# Altium project AMC_BOX_Backplane.PrjPCB
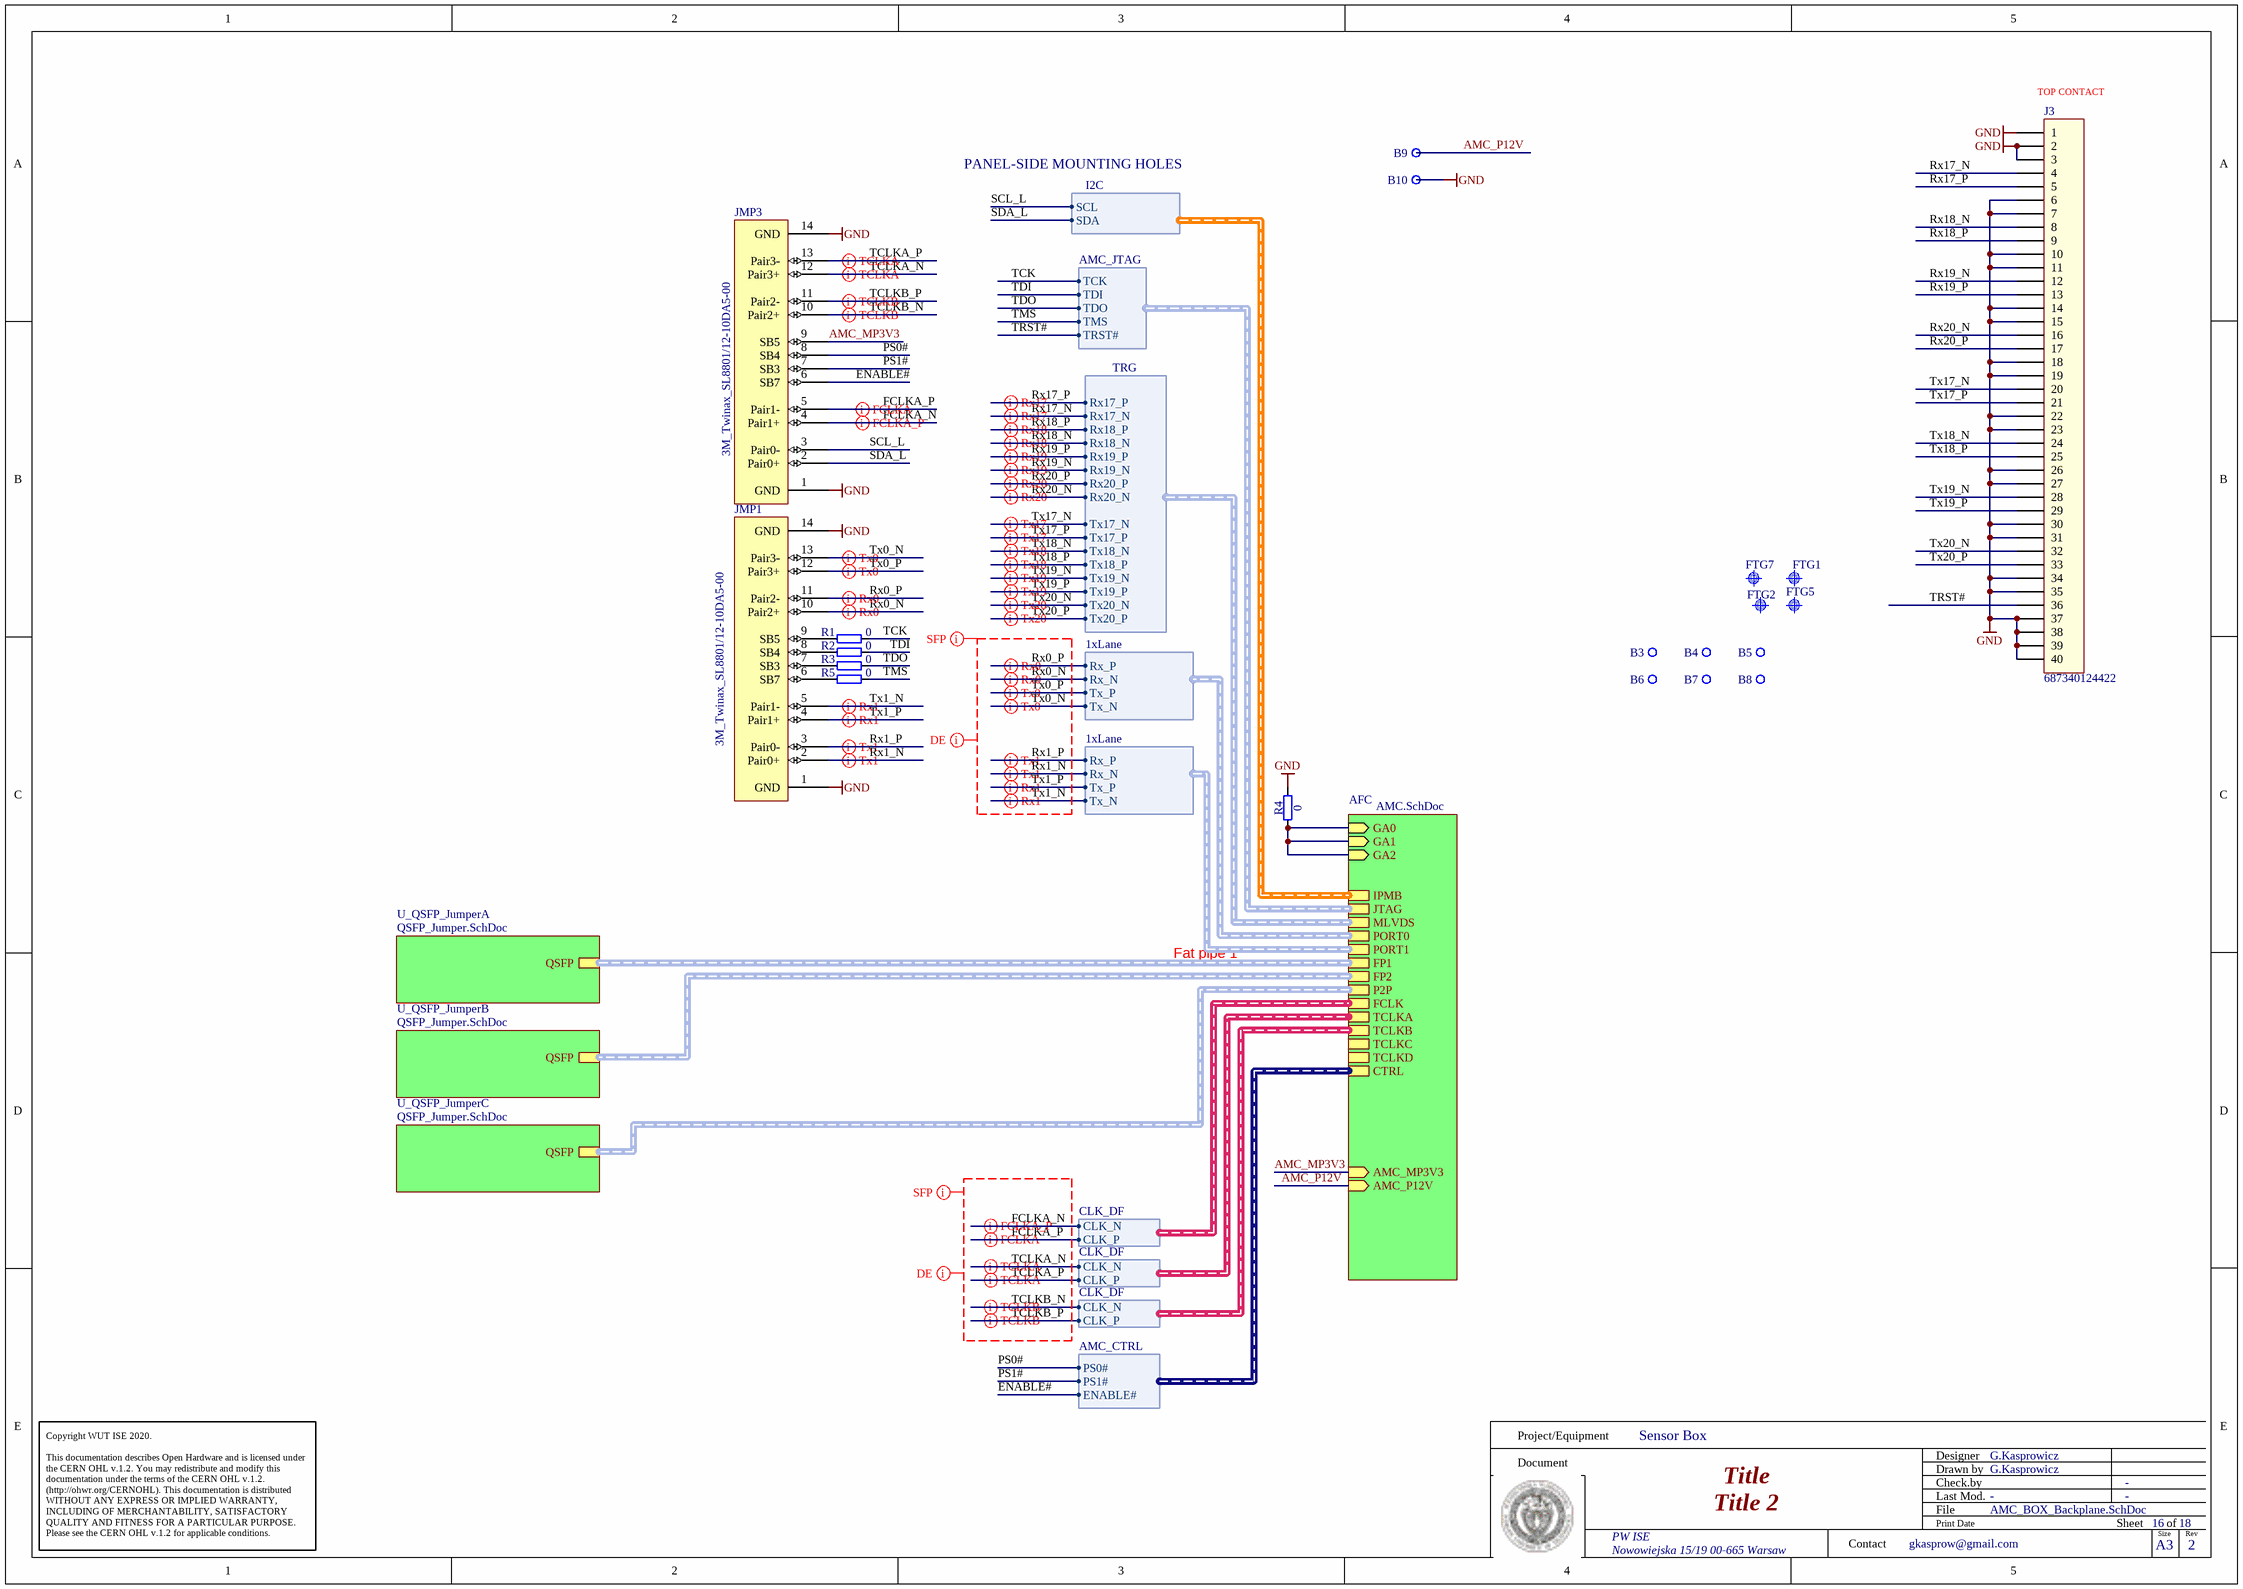
[diagram p0: AMC_BOX_Backplane.SchDoc]
3 sheets, 29 parts. Net scope: hierarchical (ports join the sheet entries above them; power ports are global).
Board file: AMC_Single_uBACKPLANE.PcbDoc
Sheets:
  AMC_BOX_Backplane.SchDoc
    AFC = AMC.SchDoc
    U_QSFP_JumperA = QSFP_Jumper.SchDoc
    U_QSFP_JumperB = QSFP_Jumper.SchDoc
    U_QSFP_JumperC = QSFP_Jumper.SchDoc

## Sheet AMC_BOX_Backplane.SchDoc: Title
size 420 x 297 mm; Author: G.Kasprowicz; CompanyName: WUT ISE; DrawnBy: G.Kasprowicz; Organization: WUT ISE; Address1: PW ISE; Address2: Nowowiejska 15/19 00-665 Warsaw; Address3: gkasprow@gmail.com; DocumentNumber: 16; Revision: 2; SheetNumber: 16; SheetTotal: 18; ModifiedBy: -; CheckedDate: -; Title2: Title 2; DivGrp: WUT ISE; Designer: G.Kasprowicz; ModifiedDate: -; ProjectName: Sensor Box

### Parts
B3  Plated Hole  [MTG320_550]  (value not drawn)
B4  Plated Hole  [MTG320_550]  (value not drawn)
B5  Plated Hole  [MTG320_550]  (value not drawn)
B6  Plated Hole  [MTG320_550]  (value not drawn)
B7  Plated Hole  [MTG320_550]  (value not drawn)
B8  Plated Hole  [MTG320_550]  (value not drawn)
B9  Plated Hole  [c200h150]  (value not drawn)
B10  Plated Hole  [c200h150]  (value not drawn)
FTG1  Use only in PCB  [FIDUCIAL_TOP_S100-200]  (value not drawn)
FTG2  Use only in PCB  [FIDUCIAL_TOP_S100-200]  (value not drawn)
FTG5  Use only in PCB  [FIDUCIAL_TOP_S100-200]  (value not drawn)
FTG7  Use only in PCB  [FIDUCIAL_TOP_S100-200]  (value not drawn)
J3  687340124422  [687340124422]
JMP1  3M_Twinax_SL8801/12-10DA5-00  [3M_Twinax_SL8801/12-10DA5-00]
JMP3  3M_Twinax_SL8801/12-10DA5-00  [3M_Twinax_SL8801/12-10DA5-00]
R1  0  [RESC1005X40N]
R2  0  [RESC1005X40N]
R3  0  [RESC1005X40N]
R4  0  [RESC1005X40N]
R5  0  [RESC1005X40N]

### Sub-sheets
AFC = AMC.SchDoc: GA0 (in), GA1 (in), GA2 (in), MLVDS (harness TRG), PORT0 (harness 1xLane), FP2 (harness FP), PORT1 (harness 1xLane), FCLK (harness CLK_DF), TCLKA (harness CLK_DF), TCLKB (harness CLK_DF), TCLKC (harness CLK_DF), TCLKD (harness CLK_DF), FP1 (harness QSFP), AMC_P12V (in), AMC_MP3V3 (in), IPMB (harness I2C), CTRL (harness AMC_CTRL), P2P (harness FP), JTAG (harness AMC_JTAG)
U_QSFP_JumperA = QSFP_Jumper.SchDoc: QSFP (harness QSFP)
U_QSFP_JumperB = QSFP_Jumper.SchDoc: QSFP (harness QSFP)
U_QSFP_JumperC = QSFP_Jumper.SchDoc: QSFP (harness QSFP)

### Harnesses
I2C: SCL, SDA
1xLane: Rx_P, Rx_N, Tx_P, Tx_N
CLK_DF: CLK_P, CLK_N
AMC_CTRL: PS0#, PS1#, ENABLE#
TRG: Rx17_P, Rx17_N, Rx18_P, Rx18_N, Rx19_P, Rx19_N, Rx20_P, Rx20_N, Tx17_N, Tx17_P, Tx18_N, Tx18_P, Tx19_N, Tx19_P, Tx20_N, Tx20_P
AMC_JTAG: TCK, TDI, TDO, TMS, TRST#

### Nets
GND: B10.1 J3.1 J3.2 J3.3 J3.6 J3.7 J3.10 J3.11 J3.14 J3.15 J3.18 J3.19 J3.22 J3.23 J3.26 J3.27 J3.30 J3.31 J3.34 J3.35 J3.37 J3.38 J3.39 J3.40 JMP1.1(GND) JMP1.14(GND) JMP3.1(GND) JMP3.14(GND) R4.2
AMC_MP3V3: JMP3.9(SB5) ; sheet AFC/AMC_MP3V3
AMC_P12V: B9.1 ; sheet AFC/AMC_P12V
ENABLE#: JMP3.6(SB7) ; sheet AFC/CTRL.ENABLE#
FCLKA_N: JMP3.4(Pair1+) ; sheet AFC/FCLK.CLK_N
FCLKA_P: JMP3.5(Pair1-) ; sheet AFC/FCLK.CLK_P
GA0: R4.1 ; sheet AFC/GA0, sheet AFC/GA1, sheet AFC/GA2
PS0#: JMP3.8(SB4) ; sheet AFC/CTRL.PS0#
PS1#: JMP3.7(SB3) ; sheet AFC/CTRL.PS1#
Rx0_N: JMP1.10(Pair2+) ; sheet AFC/PORT0.Rx_N
Rx0_P: JMP1.11(Pair2-) ; sheet AFC/PORT0.Rx_P
Rx1_N: JMP1.2(Pair0+) ; sheet AFC/PORT1.Rx_N
Rx1_P: JMP1.3(Pair0-) ; sheet AFC/PORT1.Rx_P
Rx17_N: J3.4 ; sheet AFC/MLVDS.Rx17_N
Rx17_P: J3.5 ; sheet AFC/MLVDS.Rx17_P
Rx18_N: J3.8 ; sheet AFC/MLVDS.Rx18_N
Rx18_P: J3.9 ; sheet AFC/MLVDS.Rx18_P
Rx19_N: J3.12 ; sheet AFC/MLVDS.Rx19_N
Rx19_P: J3.13 ; sheet AFC/MLVDS.Rx19_P
Rx20_N: J3.16 ; sheet AFC/MLVDS.Rx20_N
Rx20_P: J3.17 ; sheet AFC/MLVDS.Rx20_P
SCL_L: JMP3.3(Pair0-) ; sheet AFC/IPMB.SCL
SDA_L: JMP3.2(Pair0+) ; sheet AFC/IPMB.SDA
TCK: R1.2 ; sheet AFC/JTAG.TCK
TCLKA_N: JMP3.12(Pair3+) ; sheet AFC/TCLKA.CLK_N
TCLKA_P: JMP3.13(Pair3-) ; sheet AFC/TCLKA.CLK_P
TCLKB_N: JMP3.10(Pair2+) ; sheet AFC/TCLKB.CLK_N
TCLKB_P: JMP3.11(Pair2-) ; sheet AFC/TCLKB.CLK_P
TDI: R2.2 ; sheet AFC/JTAG.TDI
TDO: R3.2 ; sheet AFC/JTAG.TDO
TMS: R5.2 ; sheet AFC/JTAG.TMS
TRST#: J3.36 ; sheet AFC/JTAG.TRST#
Tx0_N: JMP1.13(Pair3-) ; sheet AFC/PORT0.Tx_N
Tx0_P: JMP1.12(Pair3+) ; sheet AFC/PORT0.Tx_P
Tx1_N: JMP1.5(Pair1-) ; sheet AFC/PORT1.Tx_N
Tx1_P: JMP1.4(Pair1+) ; sheet AFC/PORT1.Tx_P
Tx17_N: J3.20 ; sheet AFC/MLVDS.Tx17_N
Tx17_P: J3.21 ; sheet AFC/MLVDS.Tx17_P
Tx18_N: J3.24 ; sheet AFC/MLVDS.Tx18_N
Tx18_P: J3.25 ; sheet AFC/MLVDS.Tx18_P
Tx19_N: J3.28 ; sheet AFC/MLVDS.Tx19_N
Tx19_P: J3.29 ; sheet AFC/MLVDS.Tx19_P
Tx20_N: J3.32 ; sheet AFC/MLVDS.Tx20_N
Tx20_P: J3.33 ; sheet AFC/MLVDS.Tx20_P
NetJMP1_6: JMP1.6(SB7) R5.1
NetJMP1_7: JMP1.7(SB3) R3.1
NetJMP1_8: JMP1.8(SB4) R2.1
NetJMP1_9: JMP1.9(SB5) R1.1

Not connected (* = marked no-connect by the designer): B3 1; B4 1; B5 1; B6 1; B7 1; B8 1

### Buses and harness runs
harness sheet AFC/FP1 = sheet U_QSFP_JumperA/QSFP
harness sheet AFC/FP2 = sheet U_QSFP_JumperB/QSFP
harness sheet AFC/P2P = sheet U_QSFP_JumperC/QSFP

### Layout directives
differential pair: FCLKA_N, FCLKA_P, Rx0_N, Rx0_P, Rx1_N, Rx1_P, Rx17_N, Rx17_P, Rx18_N, Rx18_P, Rx19_N, Rx19_P, Rx20_N, Rx20_P, TCLKA_N, TCLKA_P, TCLKB_N, TCLKB_P, Tx0_N, Tx0_P, Tx1_N, Tx1_P, Tx17_N, Tx17_P, Tx18_N, Tx18_P, Tx19_N, Tx19_P, Tx20_N, Tx20_P
net class SFP: FCLKA_N, FCLKA_P, Rx0_N, Rx0_P, Rx1_N, Rx1_P, TCLKA_N, TCLKA_P, TCLKB_N, TCLKB_P, Tx0_N, Tx0_P, Tx1_N, Tx1_P
net class DE: FCLKA_N, FCLKA_P, Rx0_N, Rx0_P, Rx1_N, Rx1_P, TCLKA_N, TCLKA_P, TCLKB_N, TCLKB_P, Tx0_N, Tx0_P, Tx1_N, Tx1_P

### Notes on the sheet
- (near J3) TOP CONTACT
- PANEL-SIDE MOUNTING HOLES
- Fat pipe 1
- Project/Equipment
- Document
- Designer
- Drawn by
- Check.by
- Copyright WUT ISE 2020.
  This documentation describes Open Hardware and is licensed under the CERN OHL v.1.2. You may redistribute and modify this documentation under the terms of the CERN OHL v.1.2. (http://ohwr.org/CERNOHL). This documentation is distributed WITHOUT ANY EXPRESS OR IMPLIED WARRANTY, INCLUDING OF MERCHANTABILITY, SATISFACTORY QUALITY AND FITNESS FOR A PARTICULAR PURPOSE. Please see the CERN OHL v.1.2 for applicable conditions.
- Contact
- File
- Last Mod.
- Print Date
- Sheet
- Size
- A3
- of
- Rev

### Library data of the parts
B3-B8 = PLATED_HOLE3.2_PAD5.5: Single Terminal Socket; Part Description: Plated Through Hole: Hole Dia.=3.2mm Pad Dia.=5.5mm; Mounted: No; Part Number: PLATED_HOLE3.2_PAD5.5; Component Kind: Standard (No BOM); Component Type: Standard (No BOM); Pin Count: 1; Family: Plated Hole; Socket: No; SMD: No; Sense: No; Status: None; ComponentHeight: 0mm; HelpURL: Undefined; Author: CERN DEM JMW; CreateDate: 01.10.2012; LatestRevisionDate: 01.10.2012; PackageDescription: Plated Through Hole: Hole Dia.=3.2mm Pad Dia.=5.5mm
B9 B10 = PLATED_HOLE1.5_PAD2.0: Single Terminal Socket; Part Description: Plated Through Hole: Hole Dia.=1.5mm Pad Dia.=2.0mm, IPC-7251 Level C; Mounted: No; Part Number: PLATED_HOLE1.5_PAD2.0; Component Kind: Standard (No BOM); Component Type: Standard (No BOM); Pin Count: 1; Family: Plated Hole; Socket: No; SMD: No; Sense: No; Status: None; ComponentHeight: 0mm; HelpURL: Undefined; Author: CERN DEM JLC; CreateDate: 30.10.2008; LatestRevisionDate: 30.10.2008; PackageDescription: Plated Through Hole: Hole Dia.=1.5mm Pad Dia.=2.0mm, IPC-7251 Level C
FTG1 FTG2 FTG5 FTG7 = FIDUCIAL_TARGET_S100-200: Fiducial Target; Part Description: Square Fiducial Target, Top Layer, 1.0mm, Top Solder 2.0mm, Keepout =2.0mm; Mounted: No; Table: Pads; Part Number: FIDUCIAL_TARGET_S100-200; Component Kind: Standard (No BOM); Component Type: Standard (No BOM); Pin Count: 1; Family: Fiducial; Socket: No; SMD: Yes; Status: None; ComponentHeight: 0mm; Author: CERN DEM JLC; CreateDate: 2010-02-09; LatestRevisionDate: 2012-04-04; PackageDescription: Square Fiducial Target, Top Layer, 1.0mm, Top Solder 2.0mm, Keepout =2.0mm
J3 = 687340124422: 0.50 mm SMT ZIF Vertical WR-FPC, 40 pins; Pitch: 0.5 mm; Pin Number: 40; ComponentLink1Description: Manufacturer; ComponentLink1URL: http://www.we-online.de; ComponentLink2Description: Datasheet; ComponentLink2URL: http://katalog.we-online.com/em/datasheet/6873xx124422.pdf; Part Number: 687340124422; Published Date: April 2017; Publisher: Wurth Elektronik
JMP1 JMP3 = CBL_TWINAX_3M_4pairs_SB: Flat Ribbon Cable Silver 8 (4 Pair) Conductors 0.093" (2.37mm) Between Pairs Flat Twin Axial 500.0' (152.40m)
R1-R5 = R0402_0R_JUMPER: Resistor; Part Description: 1A (0.05R Max DC Resistance) Zero Ohm Jumper; Manufacturer: GENERIC; Manufacturer1 Part Number: 232270591001L; Table: Resistors SMD; Part Number: R0402_0R_JUMPER; Component Kind: Standard; Component Type: Standard; Pin Count: 2; Value: 0; Status: Not recommended; Manufacturer Part Number: R0402_0R_JUMPER; Case: 0402; Mounted: Yes; Socket: No; SMD: Yes; Manufacturer1 Example: YAGEO PHYCOMP; Manufacturer1 ComponentHeight: 0.4mm; HelpURL: \\cern.ch\dfs\Applications\Altium\Datasheets\R0402_Phycomp_RC0402.pdf; Author: CERN DEM JLC; CreateDate: 2007-12-03; LatestRevisionDate: 2012-10-17

## Sheet AMC.SchDoc: Title
size 420 x 297 mm; Author: G.Kasprowicz; CompanyName: WUT ISE; DrawnBy: G.Kasprowicz; Organization: WUT ISE; Address1: PW ISE; Address2: Nowowiejska 15/19 00-665 Warsaw; Address3: gkasprow@gmail.com; DocumentNumber: 17; Revision: 2; SheetNumber: 17; SheetTotal: 18; ModifiedBy: -; CheckedDate: -; Title2: Title 2; DivGrp: WUT ISE; Designer: G.Kasprowicz; ModifiedDate: -; ProjectName: Sensor Box
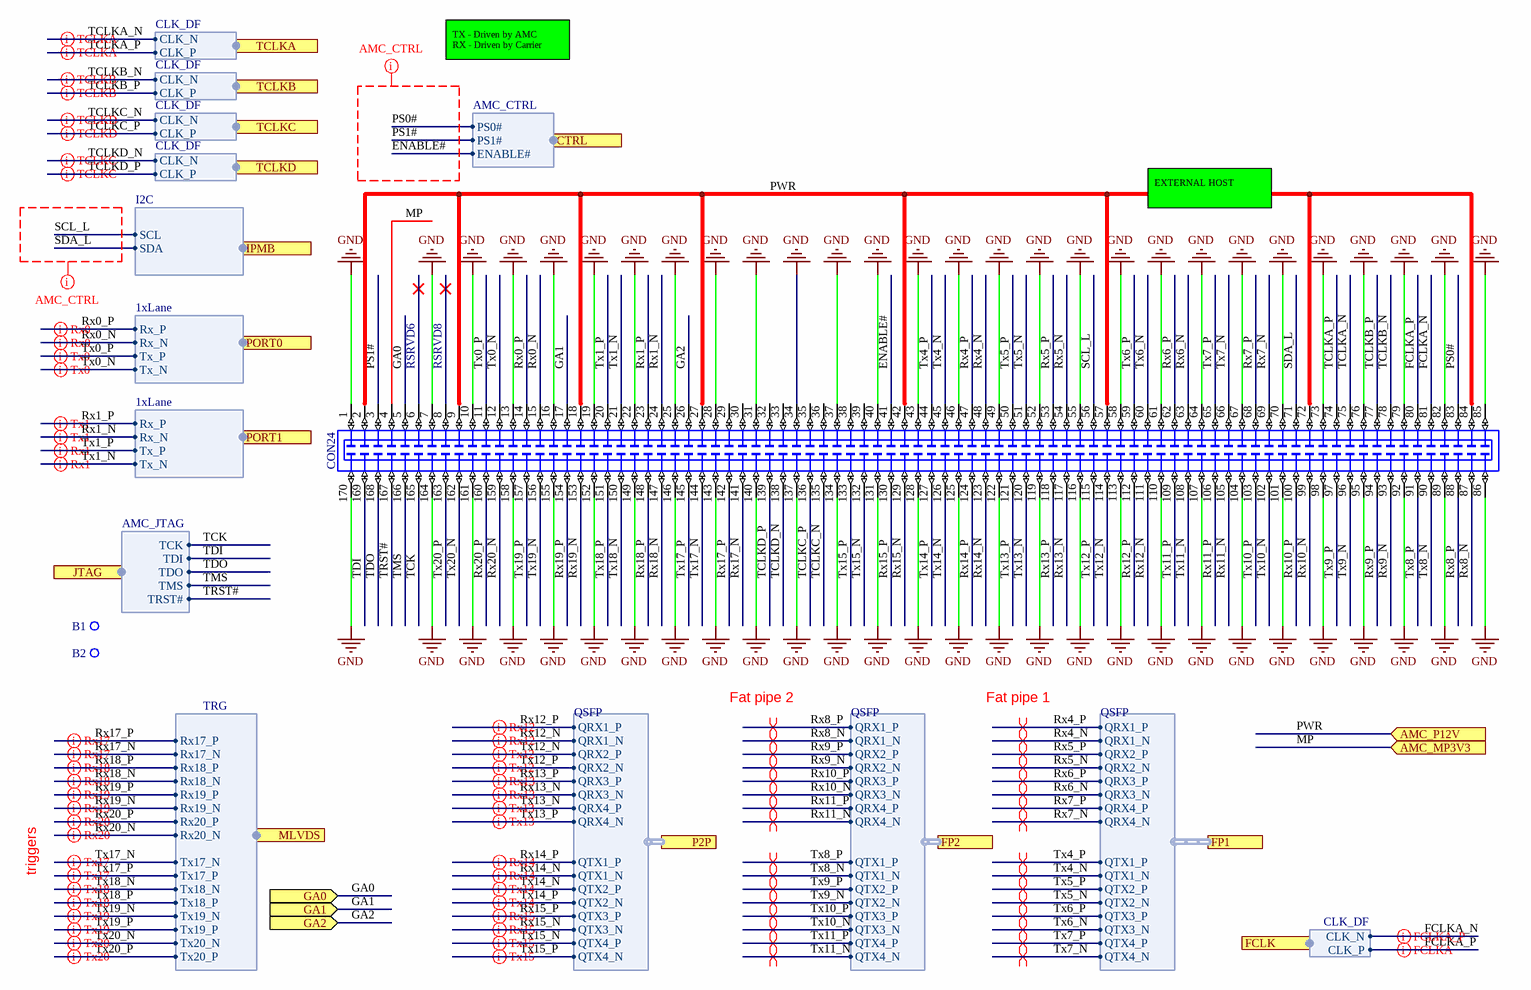
[diagram p1: AMC.SchDoc]

### Parts
B1  Plated Hole  [MTG320_550]  (value not drawn)
B2  Plated Hole  [MTG320_550]  (value not drawn)
CON24  SAMTEC_MTCA-085-02-S-DV-SMT-K-TR  [SAMTEC_MTCA-085-02-S-DV-SMT-K-TR]  (value not drawn)

### Ports
AMC_MP3V3 (in), AMC_P12V (in), CTRL (harness AMC_CTRL), FCLK (harness CLK_DF), FP1 (harness QSFP), FP2 (harness QSFP), GA0 (in), GA1 (in), GA2 (in), IPMB (harness I2C), JTAG (harness AMC_JTAG), MLVDS (harness TRG), P2P (harness QSFP), PORT0 (harness 1xLane), PORT1 (harness 1xLane), TCLKA (harness CLK_DF), TCLKB (harness CLK_DF), TCLKC (harness CLK_DF), TCLKD (harness CLK_DF)

### Harnesses
TRG: Rx17_P, Rx17_N, Rx18_P, Rx18_N, Rx19_P, Rx19_N, Rx20_P, Rx20_N, Tx17_N, Tx17_P, Tx18_N, Tx18_P, Tx19_N, Tx19_P, Tx20_N, Tx20_P
1xLane: Rx_P, Rx_N, Tx_P, Tx_N
I2C: SCL, SDA
CLK_DF: CLK_P, CLK_N
AMC_CTRL: PS0#, PS1#, ENABLE#
AMC_JTAG: TCK, TDI, TDO, TMS, TRST#
QSFP: QRX1_P, QRX1_N, QRX2_P, QRX2_N, QRX3_P, QRX3_N, QRX4_P, QRX4_N, QTX1_P, QTX1_N, QTX2_P, QTX2_N, QTX3_P, QTX3_N, QTX4_P, QTX4_N

### Nets
GND: CON24.1 CON24.7 CON24.10 CON24.13 CON24.16 CON24.19 CON24.22 CON24.25 CON24.28 CON24.31 CON24.34 CON24.37 CON24.40 CON24.43 CON24.46 CON24.49 CON24.52 CON24.55 CON24.58 CON24.61 CON24.64 CON24.67 CON24.70 CON24.73 CON24.76 CON24.79 CON24.82 CON24.85 CON24.86 CON24.89 CON24.92 CON24.95 CON24.98 CON24.101 CON24.104 CON24.107 CON24.110 CON24.113 CON24.116 CON24.119 CON24.122 CON24.125 CON24.128 CON24.131 CON24.134 CON24.137 CON24.140 CON24.143 CON24.146 CON24.149 CON24.152 CON24.155 CON24.158 CON24.161 CON24.164 CON24.170
ENABLE#: CON24.41 ; port CTRL.ENABLE#
FCLKA_N: CON24.81 ; port FCLK.CLK_N
FCLKA_P: CON24.80 ; port FCLK.CLK_P
GA0: CON24.5 CON24.17 CON24.26 ; port GA1, port GA2, port GA0  [also labelled GA1, GA2]
MP: CON24.4 ; port AMC_MP3V3  [project net AMC_MP3V3]
PS0#: CON24.83 ; port CTRL.PS0#
PS1#: CON24.3 ; port CTRL.PS1#
PWR: CON24.2 CON24.9 CON24.18 CON24.27 CON24.42 CON24.57 CON24.72 CON24.84 ; port AMC_P12V  [project net AMC_P12V]
Rx0_N: CON24.15 ; port PORT0.Rx_N
Rx0_P: CON24.14 ; port PORT0.Rx_P
Rx1_N: CON24.24 ; port PORT1.Rx_N
Rx1_P: CON24.23 ; port PORT1.Rx_P
Rx4_N: CON24.48 ; port FP1.QRX1_N  [project net QRX1_N]
Rx4_P: CON24.47 ; port FP1.QRX1_P  [project net QRX1_P]
Rx5_N: CON24.54 ; port FP1.QRX2_N  [project net QRX2_N]
Rx5_P: CON24.53 ; port FP1.QRX2_P  [project net QRX2_P]
Rx6_N: CON24.63 ; port FP1.QRX3_N  [project net QRX3_N]
Rx6_P: CON24.62 ; port FP1.QRX3_P  [project net QRX3_P]
Rx7_N: CON24.69 ; port FP1.QRX4_N  [project net QRX4_N]
Rx7_P: CON24.68 ; port FP1.QRX4_P  [project net QRX4_P]
Rx8_N: CON24.87 ; port FP2.QRX1_N  [project net QRX1_N]
Rx8_P: CON24.88 ; port FP2.QRX1_P  [project net QRX1_P]
Rx9_N: CON24.93 ; port FP2.QRX2_N  [project net QRX2_N]
Rx9_P: CON24.94 ; port FP2.QRX2_P  [project net QRX2_P]
Rx10_N: CON24.99 ; port FP2.QRX3_N  [project net QRX3_N]
Rx10_P: CON24.100 ; port FP2.QRX3_P  [project net QRX3_P]
Rx11_N: CON24.105 ; port FP2.QRX4_N  [project net QRX4_N]
Rx11_P: CON24.106 ; port FP2.QRX4_P  [project net QRX4_P]
Rx12_N: CON24.111 ; port P2P.QRX1_N  [project net QRX1_N]
Rx12_P: CON24.112 ; port P2P.QRX1_P  [project net QRX1_P]
Rx13_N: CON24.117 ; port P2P.QRX3_N  [project net QRX3_N]
Rx13_P: CON24.118 ; port P2P.QRX3_P  [project net QRX3_P]
Rx14_N: CON24.123 ; port P2P.QTX1_N  [project net QTX1_N]
Rx14_P: CON24.124 ; port P2P.QTX1_P  [project net QTX1_P]
Rx15_N: CON24.129 ; port P2P.QTX3_N  [project net QTX3_N]
Rx15_P: CON24.130 ; port P2P.QTX3_P  [project net QTX3_P]
Rx17_N: CON24.141 ; port MLVDS.Rx17_N
Rx17_P: CON24.142 ; port MLVDS.Rx17_P
Rx18_N: CON24.147 ; port MLVDS.Rx18_N
Rx18_P: CON24.148 ; port MLVDS.Rx18_P
Rx19_N: CON24.153 ; port MLVDS.Rx19_N
Rx19_P: CON24.154 ; port MLVDS.Rx19_P
Rx20_N: CON24.159 ; port MLVDS.Rx20_N
Rx20_P: CON24.160 ; port MLVDS.Rx20_P
SCL_L: CON24.56 ; port IPMB.SCL
SDA_L: CON24.71 ; port IPMB.SDA
TCK: CON24.165 ; port JTAG.TCK
TCLKA_N: CON24.75 ; port TCLKA.CLK_N
TCLKA_P: CON24.74 ; port TCLKA.CLK_P
TCLKB_N: CON24.78 ; port TCLKB.CLK_N
TCLKB_P: CON24.77 ; port TCLKB.CLK_P
TCLKC_N: CON24.135 ; port TCLKC.CLK_N
TCLKC_P: CON24.136 ; port TCLKC.CLK_P
TCLKD_N: CON24.138 ; port TCLKD.CLK_N
TCLKD_P: CON24.139 ; port TCLKD.CLK_P
TDI: CON24.169 ; port JTAG.TDI
TDO: CON24.168 ; port JTAG.TDO
TMS: CON24.166 ; port JTAG.TMS
TRST#: CON24.167 ; port JTAG.TRST#
Tx0_N: CON24.12 ; port PORT0.Tx_N
Tx0_P: CON24.11 ; port PORT0.Tx_P
Tx1_N: CON24.21 ; port PORT1.Tx_N
Tx1_P: CON24.20 ; port PORT1.Tx_P
Tx4_N: CON24.45 ; port FP1.QTX1_N  [project net QTX1_N]
Tx4_P: CON24.44 ; port FP1.QTX1_P  [project net QTX1_P]
Tx5_N: CON24.51 ; port FP1.QTX2_N  [project net QTX2_N]
Tx5_P: CON24.50 ; port FP1.QTX2_P  [project net QTX2_P]
Tx6_N: CON24.60 ; port FP1.QTX3_N  [project net QTX3_N]
Tx6_P: CON24.59 ; port FP1.QTX3_P  [project net QTX3_P]
Tx7_N: CON24.66 ; port FP1.QTX4_N  [project net QTX4_N]
Tx7_P: CON24.65 ; port FP1.QTX4_P  [project net QTX4_P]
Tx8_N: CON24.90 ; port FP2.QTX1_N  [project net QTX1_N]
Tx8_P: CON24.91 ; port FP2.QTX1_P  [project net QTX1_P]
Tx9_N: CON24.96 ; port FP2.QTX2_N  [project net QTX2_N]
Tx9_P: CON24.97 ; port FP2.QTX2_P  [project net QTX2_P]
Tx10_N: CON24.102 ; port FP2.QTX3_N  [project net QTX3_N]
Tx10_P: CON24.103 ; port FP2.QTX3_P  [project net QTX3_P]
Tx11_N: CON24.108 ; port FP2.QTX4_N  [project net QTX4_N]
Tx11_P: CON24.109 ; port FP2.QTX4_P  [project net QTX4_P]
Tx12_N: CON24.114 ; port P2P.QRX2_P  [project net QRX2_P]
Tx12_P: CON24.115 ; port P2P.QRX2_N  [project net QRX2_N]
Tx13_N: CON24.120 ; port P2P.QRX4_P  [project net QRX4_P]
Tx13_P: CON24.121 ; port P2P.QRX4_N  [project net QRX4_N]
Tx14_N: CON24.126 ; port P2P.QTX2_P  [project net QTX2_P]
Tx14_P: CON24.127 ; port P2P.QTX2_N  [project net QTX2_N]
Tx15_N: CON24.132 ; port P2P.QTX4_P  [project net QTX4_P]
Tx15_P: CON24.133 ; port P2P.QTX4_N  [project net QTX4_N]
Tx17_N: CON24.144 ; port MLVDS.Tx17_N
Tx17_P: CON24.145 ; port MLVDS.Tx17_P
Tx18_N: CON24.150 ; port MLVDS.Tx18_N
Tx18_P: CON24.151 ; port MLVDS.Tx18_P
Tx19_N: CON24.156 ; port MLVDS.Tx19_N
Tx19_P: CON24.157 ; port MLVDS.Tx19_P
Tx20_N: CON24.162 ; port MLVDS.Tx20_N
Tx20_P: CON24.163 ; port MLVDS.Tx20_P

Not connected (* = marked no-connect by the designer): B1 1; B2 1; CON24 6* 8* 29 30 32 33 35 36 38 39

### Layout directives
differential pair: FCLKA_N, FCLKA_P, QRX1_N, QRX1_P, QRX2_N, QRX2_P, QRX3_N, QRX3_P, QRX4_N, QRX4_P, QTX1_N, QTX1_P, QTX2_N, QTX2_P, QTX3_N, QTX3_P, QTX4_N, QTX4_P, Rx0_N, Rx0_P, Rx1_N, Rx1_P, Rx17_N, Rx17_P, Rx18_N, Rx18_P, Rx19_N, Rx19_P, Rx20_N, Rx20_P, TCLKA_N, TCLKA_P, TCLKB_N, TCLKB_P, TCLKC_N, TCLKC_P, TCLKD_N, TCLKD_P, Tx0_N, Tx0_P, Tx1_N, Tx1_P, Tx17_N, Tx17_P, Tx18_N, Tx18_P, Tx19_N, Tx19_P, Tx20_N, Tx20_P
net class AMC_CTRL: ENABLE#, PS0#, PS1#, SCL_L, SDA_L

### Notes on the sheet
- TX - Driven by AMC
  RX - Driven by Carrier
- EXTERNAL HOST
- RSRVD6
- RSRVD8
- Fat pipe 2
- Fat pipe 1
- triggers
- Project/Equipment
- Document
- Designer
- Drawn by
- Check.by
- Copyright WUT ISE 2020.
  This documentation describes Open Hardware and is licensed under the CERN OHL v.1.2. You may redistribute and modify this documentation under the terms of the CERN OHL v.1.2. (http://ohwr.org/CERNOHL). This documentation is distributed WITHOUT ANY EXPRESS OR IMPLIED WARRANTY, INCLUDING OF MERCHANTABILITY, SATISFACTORY QUALITY AND FITNESS FOR A PARTICULAR PURPOSE. Please see the CERN OHL v.1.2 for applicable conditions.
- Contact
- File
- Last Mod.
- Print Date
- Sheet
- Size
- A3
- of
- Rev

### Library data of the parts
B1 B2 = PLATED_HOLE3.2_PAD5.5: as B3 on sheet AMC_BOX_Backplane; Part Number: PLATED_HOLE3.2_PAD5.5; Component Kind: Standard (No BOM); Component Type: Standard (No BOM); Pin Count: 1; Family: Plated Hole; Socket: No; SMD: No; Sense: No; Status: None; ComponentHeight: 0mm; HelpURL: Undefined; Author: CERN DEM JMW; CreateDate: 01.10.2012; LatestRevisionDate: 01.10.2012; PackageDescription: Plated Through Hole: Hole Dia.=3.2mm Pad Dia.=5.5mm
CON24 = SAMTEC_MTCA-085-02-S-DV-SMT-K-TR: 170 Poles,  Micro TCA (Telecom Computing Architecture) Edge Card Socket; Part Description: 170 Poles, Pitch 0.75mm, Micro TCA (Telecom Computing Architecture) Edge Card Socket; Manufacturer: SAMTEC; Part Number: SAMTEC_MTCA-085-02-S-DV-SMT-K-TR; Component Kind: Standard; Component Type: Standard; Pin Count: 170; Mounted: Yes; Socket: No; SMD: Yes; Status: None; Manufacturer Part Number: MTCA-085-02-S-DV-SMT-K-TR; ComponentHeight: 12.85mm; HelpURL: \\cern.ch\dfs\Applications\Altium\Datasheets\SAMTEC_MTCA-085-02-S-DV-SMT-K-TR.pdf; Author: CERN DEM JLC; CreateDate: 2012-08-15; LatestRevisionDate: 2012-08-15; Table: SAMTEC

## Sheet QSFP_Jumper.SchDoc
size A4
Used 3 times, as channels U_QSFP_JumperA, U_QSFP_JumperB, U_QSFP_JumperC. Parts and nets are listed once, with the designators drawn on the sheet.
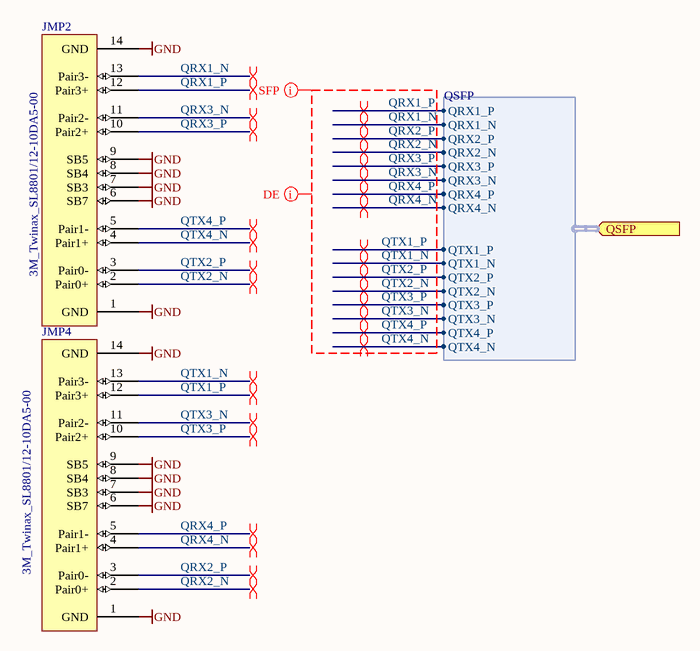
[diagram p2: QSFP_Jumper.SchDoc]

### Parts
JMP2  3M_Twinax_SL8801/12-10DA5-00  [3M_Twinax_SL8801/12-10DA5-00]
JMP4  3M_Twinax_SL8801/12-10DA5-00  [3M_Twinax_SL8801/12-10DA5-00]

### Ports
QSFP (in, harness QSFP)

### Harnesses
QSFP: QRX1_P, QRX1_N, QRX2_P, QRX2_N, QRX3_P, QRX3_N, QRX4_P, QRX4_N, QTX1_P, QTX1_N, QTX2_P, QTX2_N, QTX3_P, QTX3_N, QTX4_P, QTX4_N

### Nets
GND: JMP2.1(GND) JMP2.6(SB7) JMP2.7(SB3) JMP2.8(SB4) JMP2.9(SB5) JMP2.14(GND) JMP4.1(GND) JMP4.6(SB7) JMP4.7(SB3) JMP4.8(SB4) JMP4.9(SB5) JMP4.14(GND)
QRX1_N: JMP2.13(Pair3-) ; port QSFP.QRX1_N
QRX1_P: JMP2.12(Pair3+) ; port QSFP.QRX1_P
QRX2_N: JMP4.2(Pair0+) ; port QSFP.QRX2_N
QRX2_P: JMP4.3(Pair0-) ; port QSFP.QRX2_P
QRX3_N: JMP2.11(Pair2-) ; port QSFP.QRX3_N
QRX3_P: JMP2.10(Pair2+) ; port QSFP.QRX3_P
QRX4_N: JMP4.4(Pair1+) ; port QSFP.QRX4_N
QRX4_P: JMP4.5(Pair1-) ; port QSFP.QRX4_P
QTX1_N: JMP4.13(Pair3-) ; port QSFP.QTX1_N
QTX1_P: JMP4.12(Pair3+) ; port QSFP.QTX1_P
QTX2_N: JMP2.2(Pair0+) ; port QSFP.QTX2_N
QTX2_P: JMP2.3(Pair0-) ; port QSFP.QTX2_P
QTX3_N: JMP4.11(Pair2-) ; port QSFP.QTX3_N
QTX3_P: JMP4.10(Pair2+) ; port QSFP.QTX3_P
QTX4_N: JMP2.4(Pair1+) ; port QSFP.QTX4_N
QTX4_P: JMP2.5(Pair1-) ; port QSFP.QTX4_P

### Channels
U_QSFP_JumperA: designators end in A
U_QSFP_JumperB: designators end in B
U_QSFP_JumperC: designators end in C

### Layout directives
differential pair: QRX1_N, QRX1_P, QRX2_N, QRX2_P, QRX3_N, QRX3_P, QRX4_N, QRX4_P, QTX1_N, QTX1_P, QTX2_N, QTX2_P, QTX3_N, QTX3_P, QTX4_N, QTX4_P
net class SFP: QRX1_N, QRX1_P, QRX2_N, QRX2_P, QRX3_N, QRX3_P, QRX4_N, QRX4_P, QTX1_N, QTX1_P, QTX2_N, QTX2_P, QTX3_N, QTX3_P, QTX4_N, QTX4_P
net class DE: QRX1_N, QRX1_P, QRX2_N, QRX2_P, QRX3_N, QRX3_P, QRX4_N, QRX4_P, QTX1_N, QTX1_P, QTX2_N, QTX2_P, QTX3_N, QTX3_P, QTX4_N, QTX4_P

### Library data of the parts
JMP2 JMP4 = CBL_TWINAX_3M_4pairs_SB: as JMP1 on sheet AMC_BOX_Backplane

## Nets that join several sheets
GND: AMC_BOX_Backplane (29 pins), AMC (56 pins), U_QSFP_JumperA (12 pins), U_QSFP_JumperB (12 pins), U_QSFP_JumperC (12 pins)
AMC_MP3V3: AMC_BOX_Backplane (JMP3.9), AMC (CON24.4)
AMC_P12V: AMC_BOX_Backplane (B9.1), AMC (8 pins)
ENABLE#: AMC_BOX_Backplane (JMP3.6), AMC (CON24.41)
FCLKA_N: AMC_BOX_Backplane (JMP3.4), AMC (CON24.81)
FCLKA_P: AMC_BOX_Backplane (JMP3.5), AMC (CON24.80)
GA0: AMC_BOX_Backplane (R4.1), AMC (CON24.5 CON24.17 CON24.26)
PS0#: AMC_BOX_Backplane (JMP3.8), AMC (CON24.83)
PS1#: AMC_BOX_Backplane (JMP3.7), AMC (CON24.3)
QRX1_N: AMC (CON24.48), U_QSFP_JumperA (JMP2A.13)
QRX1_N: AMC (CON24.87), U_QSFP_JumperB (JMP2B.13)
QRX1_N: AMC (CON24.111), U_QSFP_JumperC (JMP2C.13)
QRX1_P: AMC (CON24.47), U_QSFP_JumperA (JMP2A.12)
QRX1_P: AMC (CON24.88), U_QSFP_JumperB (JMP2B.12)
QRX1_P: AMC (CON24.112), U_QSFP_JumperC (JMP2C.12)
QRX2_N: AMC (CON24.54), U_QSFP_JumperA (JMP4A.2)
QRX2_N: AMC (CON24.93), U_QSFP_JumperB (JMP4B.2)
QRX2_N: AMC (CON24.115), U_QSFP_JumperC (JMP4C.2)
QRX2_P: AMC (CON24.53), U_QSFP_JumperA (JMP4A.3)
QRX2_P: AMC (CON24.94), U_QSFP_JumperB (JMP4B.3)
QRX2_P: AMC (CON24.114), U_QSFP_JumperC (JMP4C.3)
QRX3_N: AMC (CON24.63), U_QSFP_JumperA (JMP2A.11)
QRX3_N: AMC (CON24.99), U_QSFP_JumperB (JMP2B.11)
QRX3_N: AMC (CON24.117), U_QSFP_JumperC (JMP2C.11)
QRX3_P: AMC (CON24.62), U_QSFP_JumperA (JMP2A.10)
QRX3_P: AMC (CON24.100), U_QSFP_JumperB (JMP2B.10)
QRX3_P: AMC (CON24.118), U_QSFP_JumperC (JMP2C.10)
QRX4_N: AMC (CON24.69), U_QSFP_JumperA (JMP4A.4)
QRX4_N: AMC (CON24.105), U_QSFP_JumperB (JMP4B.4)
QRX4_N: AMC (CON24.121), U_QSFP_JumperC (JMP4C.4)
QRX4_P: AMC (CON24.68), U_QSFP_JumperA (JMP4A.5)
QRX4_P: AMC (CON24.106), U_QSFP_JumperB (JMP4B.5)
QRX4_P: AMC (CON24.120), U_QSFP_JumperC (JMP4C.5)
QTX1_N: AMC (CON24.45), U_QSFP_JumperA (JMP4A.13)
QTX1_N: AMC (CON24.90), U_QSFP_JumperB (JMP4B.13)
QTX1_N: AMC (CON24.123), U_QSFP_JumperC (JMP4C.13)
QTX1_P: AMC (CON24.44), U_QSFP_JumperA (JMP4A.12)
QTX1_P: AMC (CON24.91), U_QSFP_JumperB (JMP4B.12)
QTX1_P: AMC (CON24.124), U_QSFP_JumperC (JMP4C.12)
QTX2_N: AMC (CON24.51), U_QSFP_JumperA (JMP2A.2)
QTX2_N: AMC (CON24.96), U_QSFP_JumperB (JMP2B.2)
QTX2_N: AMC (CON24.127), U_QSFP_JumperC (JMP2C.2)
QTX2_P: AMC (CON24.50), U_QSFP_JumperA (JMP2A.3)
QTX2_P: AMC (CON24.97), U_QSFP_JumperB (JMP2B.3)
QTX2_P: AMC (CON24.126), U_QSFP_JumperC (JMP2C.3)
QTX3_N: AMC (CON24.60), U_QSFP_JumperA (JMP4A.11)
QTX3_N: AMC (CON24.102), U_QSFP_JumperB (JMP4B.11)
QTX3_N: AMC (CON24.129), U_QSFP_JumperC (JMP4C.11)
QTX3_P: AMC (CON24.59), U_QSFP_JumperA (JMP4A.10)
QTX3_P: AMC (CON24.103), U_QSFP_JumperB (JMP4B.10)
QTX3_P: AMC (CON24.130), U_QSFP_JumperC (JMP4C.10)
QTX4_N: AMC (CON24.66), U_QSFP_JumperA (JMP2A.4)
QTX4_N: AMC (CON24.108), U_QSFP_JumperB (JMP2B.4)
QTX4_N: AMC (CON24.133), U_QSFP_JumperC (JMP2C.4)
QTX4_P: AMC (CON24.65), U_QSFP_JumperA (JMP2A.5)
QTX4_P: AMC (CON24.109), U_QSFP_JumperB (JMP2B.5)
QTX4_P: AMC (CON24.132), U_QSFP_JumperC (JMP2C.5)
Rx0_N: AMC_BOX_Backplane (JMP1.10), AMC (CON24.15)
Rx0_P: AMC_BOX_Backplane (JMP1.11), AMC (CON24.14)
Rx1_N: AMC_BOX_Backplane (JMP1.2), AMC (CON24.24)
Rx1_P: AMC_BOX_Backplane (JMP1.3), AMC (CON24.23)
Rx17_N: AMC_BOX_Backplane (J3.4), AMC (CON24.141)
Rx17_P: AMC_BOX_Backplane (J3.5), AMC (CON24.142)
Rx18_N: AMC_BOX_Backplane (J3.8), AMC (CON24.147)
Rx18_P: AMC_BOX_Backplane (J3.9), AMC (CON24.148)
Rx19_N: AMC_BOX_Backplane (J3.12), AMC (CON24.153)
Rx19_P: AMC_BOX_Backplane (J3.13), AMC (CON24.154)
Rx20_N: AMC_BOX_Backplane (J3.16), AMC (CON24.159)
Rx20_P: AMC_BOX_Backplane (J3.17), AMC (CON24.160)
SCL_L: AMC_BOX_Backplane (JMP3.3), AMC (CON24.56)
SDA_L: AMC_BOX_Backplane (JMP3.2), AMC (CON24.71)
TCK: AMC_BOX_Backplane (R1.2), AMC (CON24.165)
TCLKA_N: AMC_BOX_Backplane (JMP3.12), AMC (CON24.75)
TCLKA_P: AMC_BOX_Backplane (JMP3.13), AMC (CON24.74)
TCLKB_N: AMC_BOX_Backplane (JMP3.10), AMC (CON24.78)
TCLKB_P: AMC_BOX_Backplane (JMP3.11), AMC (CON24.77)
TDI: AMC_BOX_Backplane (R2.2), AMC (CON24.169)
TDO: AMC_BOX_Backplane (R3.2), AMC (CON24.168)
TMS: AMC_BOX_Backplane (R5.2), AMC (CON24.166)
TRST#: AMC_BOX_Backplane (J3.36), AMC (CON24.167)
Tx0_N: AMC_BOX_Backplane (JMP1.13), AMC (CON24.12)
Tx0_P: AMC_BOX_Backplane (JMP1.12), AMC (CON24.11)
Tx1_N: AMC_BOX_Backplane (JMP1.5), AMC (CON24.21)
Tx1_P: AMC_BOX_Backplane (JMP1.4), AMC (CON24.20)
Tx17_N: AMC_BOX_Backplane (J3.20), AMC (CON24.144)
Tx17_P: AMC_BOX_Backplane (J3.21), AMC (CON24.145)
Tx18_N: AMC_BOX_Backplane (J3.24), AMC (CON24.150)
Tx18_P: AMC_BOX_Backplane (J3.25), AMC (CON24.151)
Tx19_N: AMC_BOX_Backplane (J3.28), AMC (CON24.156)
Tx19_P: AMC_BOX_Backplane (J3.29), AMC (CON24.157)
Tx20_N: AMC_BOX_Backplane (J3.32), AMC (CON24.162)
Tx20_P: AMC_BOX_Backplane (J3.33), AMC (CON24.163)